# EasyEDA Pro project 12-4-202490deg_new pcb design_2024-12-04.epro

# Schematic Schematic1
Board Name: Board1; Create Date: 2024-11-25; Page Name: P1; Project Name: new pcb design; Schematic Name: Schematic1; Update Date: 2024-12-03; Company: EasyEDA.com; Page Size: A4; Version: V2.0
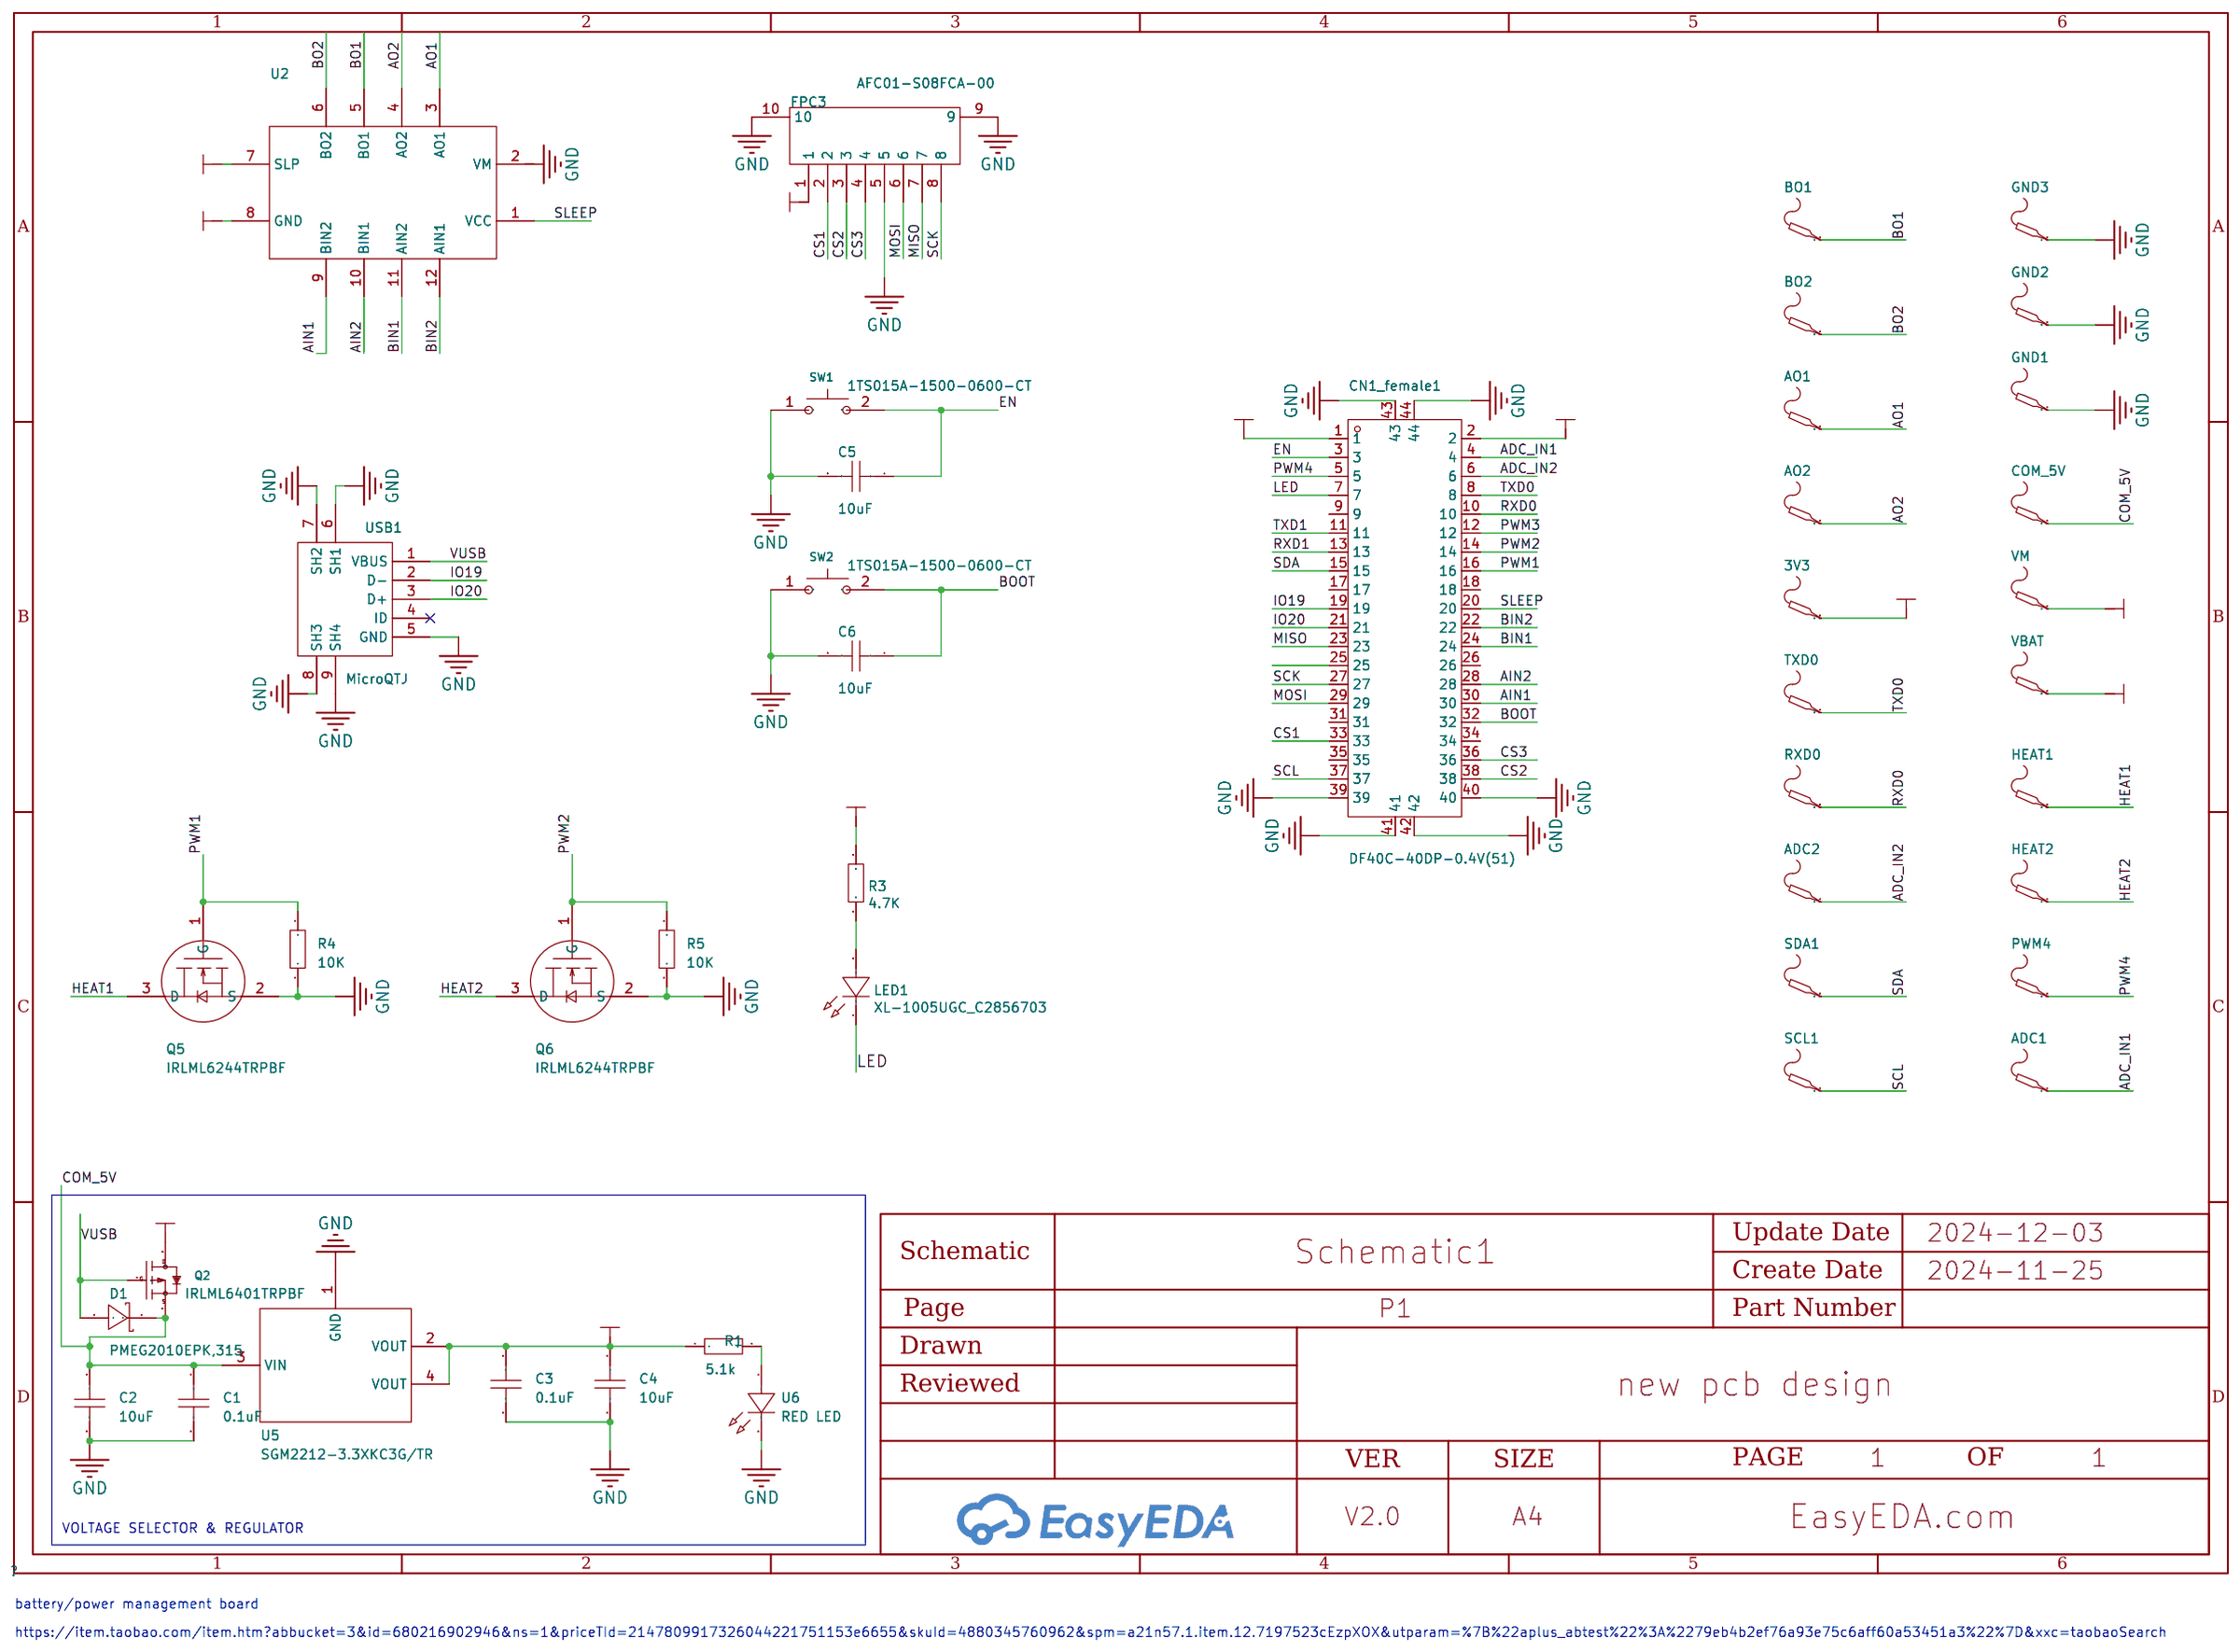
[diagram p0: schematic sheet]

## Parts
3V3  -  [Test-Point-0.5mm]
ADC1  -  [Test-Point-0.5mm]
ADC2  -  [Test-Point-0.5mm]
AO1  -  [Test-Point-0.5mm]
AO2  -  [Test-Point-0.5mm]
BO1  -  [Test-Point-0.5mm]
BO2  -  [Test-Point-0.5mm]
C1  0.1uF  [C0603]
C2  10uF  [C0603]
C3  0.1uF  [C0603]
C4  10uF  [C0603]
C5  10uF  [C0603]
C6  10uF  [C0603]
CN1_female1  DF40C-40DP-0.4V(51)  [CONN-SMD_DF40C-40DP-0.4V]
COM_5V  -  [Test-Point-0.5mm]
D1  PMEG2010EPK,315  [SOD1608_L1.6-W0.8-LS1.6-RD]
FPC3  AFC01-S08FCA-00  [FPC-SMD_P0.50-8P_FGS-XJ-H2.0]
GND1  -  [Test-Point-0.5mm]
GND2  -  [Test-Point-0.5mm]
GND3  -  [Test-Point-0.5mm]
HEAT1  -  [Test-Point-0.5mm]
HEAT2  -  [Test-Point-0.5mm]
LED1  XL-1005UGC_C2856703  [LED0402-RD_GREEN]
PWM4  -  [Test-Point-0.5mm]
Q2  IRLML6401TRPBF  [SOT-23-3_L2.9-W1.3-P1.90-LS2.4-BR]
Q5  IRLML6244TRPBF  [SOT-23-3_L2.9-W1.3-P1.90-LS2.4-BR]
Q6  IRLML6244TRPBF  [SOT-23-3_L2.9-W1.3-P1.90-LS2.4-BR]
R1  5.1k  [R0603]
R3  4.7K  [R0402]
R4  10K  [R0603]
R5  10K  [R0603]
RXD0  -  [Test-Point-0.5mm]
SCL1  -  [Test-Point-0.5mm]
SDA1  -  [Test-Point-0.5mm]
SW1  1TS015A-1500-0600-CT  [SW-SMD_L3.0-W2.0-LS3.5]
SW2  1TS015A-1500-0600-CT  [SW-SMD_L3.0-W2.0-LS3.5]
TXD0  -  [Test-Point-0.5mm]
U2  -  [DOUBLE_DRV8210]
U5  SGM2212-3.3XKC3G/TR  [SOT-223-4_L6.5-W3.5-P2.30-LS7.0-BR]
U6  RED LED  [LED0402-R-RD]
USB1  MicroQTJ  [MICRO-USB-SMD_MICROQTJ-5P]
VBAT  -  [Test-Point-0.5mm]
VM  -  [Test-Point-0.5mm]

## Library data of the parts
3V3 ADC1 ADC2 AO1 AO2 BO1 BO2 COM_5V GND1-GND3 HEAT1 HEAT2 PWM4 RXD0 SCL1 SDA1 TXD0 VBAT VM = Test-Point: Test Point 测试点
C1-C6 = CAP_0603: Supplier Footprint: 0603
CN1_female1 = DF40C-40DP-0.4V(51): Number of Pins:- Pitch:0.4mm Mounting Style:Standing paste Number of Rows:2 Current Rating (Max):300mA Contact Plating:Gold Operating Temperature Range:-35℃~+85℃ Operating Temperature Range:-35℃~+85℃; LCSC Part Name: 间距:0.4mm 公 立贴; Supplier Part: C424643; Manufacturer: HRS(广濑); Supplier Footprint: SMD,P=0.4mm; JLCPCB Part Class: Extended Part; Datasheet: https://atta.szlcsc.com/upload/public/pdf/source/20190903/C424648_4BEB475664B3701E3114D0DD20EED667.pdf; Supplier: LCSC; Pitch: 0.4mm; Mounting Style: Standing paste; Number of Rows: 2; Current Rating (Max): 300mA; Contact Plating: Gold; Operating Temperature Range: -35℃~+85℃
D1 = PMEG2010EPK,315: Forward Voltage (Vf@If):415mV@1A Reverse Voltage (Vr):20V Rectified Current:1A Reverse Leakage Current (Ir):600uA@20V; LCSC Part Name: 电压:20V 电流:1A; Supplier Part: C552829; Manufacturer: Nexperia(安世); Supplier Footprint: DFN1608-2; JLCPCB Part Class: Extended Part; Datasheet: https://atta.szlcsc.com/upload/public/pdf/source/20200610/C552829_3AF2334668204E48D61AA8E7CF1AE1A5.pdf; Supplier: LCSC; Forward Voltage (Vf@If): 415mV@1A; Reverse Voltage (Vr): 20V; Rectified Current: 1A; Reverse Leakage Current (Ir): 600uA@20V
FPC3 = AFC01-S08FCA-00: Locking Feature:Clamshell Contact Type:Bottom Contact Number of Contacts:8P Pitch:0.5mm Mounting Type:卧贴 FFC, FCB Thickness:0.3mm FFC, FCB Thickness:0.3mm Height Above Board:2mm; LCSC Part Name: 间距:0.5mm P数:8P 翻盖式 下接; Supplier Part: C262657; Manufacturer: JS(钜硕电子); Supplier Footprint: SMD,P=0.5mm,卧贴; JLCPCB Part Class: Extended Part; Datasheet: https://atta.szlcsc.com/upload/public/pdf/source/20190816/C413942_2A72D1AC756EAE17EEDF756A339D4500.pdf; Supplier: LCSC; Locking Feature: Clamshell; Contact Type: Bottom Contact; Number of Contacts: 8P; Pitch: 0.5mm; Mounting Type: 卧贴; FFC, FCB Thickness: 0.3mm; Height Above Board: 2mm
LED1 = XL-1005UGC_C2856703: link: https://so.szlcsc.com/global.html?k=C2856703&amp;ref=editor; 3DModel: LED0402_L1.0-W0.5-H0.2; Supplier: LCSC; Supplier Part: C2856703; Manufacturer: XINGLIGHT(成兴光); Manufacturer Part: XL-1005UGC; JLCPCB Part Class: Extended Part
Q2 = IRLML6401TRPBF_C5182042: Supplier Part: C5182042; Manufacturer: TECH PUBLIC(台舟); Supplier Footprint: SOT-23; Datasheet: https://atta.szlcsc.com/upload/public/pdf/source/20220927/F94DD8E07BE7777460EDDF0B320F674D.pdf; Supplier: LCSC
Q5 Q6 = IRLML6244TRPBF: Type:1 N-Channel Drain Source Voltage (Vdss): Continuous Drain Current (Id): Drain Source On Resistance (RDS(on)@Vgs,Id):21mΩ@4.5V,6.3A Power Dissipation (Pd): Gate Threshold Voltage (Vgs(th)@Id):0.9V@10uA Total Gate Charge (Qg@Vgs):8.9nC Input Capacitanc; LCSC Part Name: 1个N沟道 耐压:20V 电流:6.3A; Supplier Part: C143946; Manufacturer: Infineon(英飞凌); Supplier Footprint: SOT-23; JLCPCB Part Class: Extended Part; Datasheet: https://atta.szlcsc.com/upload/public/pdf/source/20171123/C143946_15114110845441137804.pdf; Supplier: LCSC; Type: 1 N-Channel; Drain Source On Resistance (RDS(on)@Vgs,Id): 21mΩ@4.5V,6.3A; Gate Threshold Voltage (Vgs(th)@Id): 0.9V@10uA; Total Gate Charge (Qg@Vgs): 8.9nC; Input Capacitance (Ciss@Vds): 700pF; Reverse Transfer Capacitance (Crss@Vds): 98pF; Operating Temperature: -55℃~+150℃
R1 R4 R5 = Res_0603: Supplier Footprint: 0603
R3 = 4.7K: link: https://so.szlcsc.com/global.html?k=C60490&amp;ref=editor; 3DModel: R0402_L1.0-W0.5-H0.5; Supplier: LCSC; Manufacturer: YAGEO(国巨); Manufacturer Part: RC0402FR-0710KL; Supplier Part: C60490; JLCPCB Part Class: Extended Part
SW1 SW2 = 1TS015A-1500-0600-CT: Circuit:SPST Actuator Style:Round Button Operating Force:150gf Mounting Style:Brick nogging Switch Length:3mm Switch Width:2mm Switch Height:0.6mm Strike Gundam:不带 Contact Current:50mA Voltage Rating (DC):12V Power Rating:0.6W Insulation Resistance:100MΩ; LCSC Part Name: 3*2*0.6mm 立贴 轻触开关; Supplier Part: C319434; Manufacturer: HYP(鸿源精密); Supplier Footprint: SMD,2x3mm; JLCPCB Part Class: Extended Part; Datasheet: https://atta.szlcsc.com/upload/public/pdf/source/20181106/C319434_B3AA23CF9D2B2E70128718BA7D32871A.pdf; Supplier: LCSC; Circuit: SPST; Actuator Style: Round Button; Operating Force: 150gf; Mounting Style: Brick nogging; Switch Length: 3mm; Switch Width: 2mm; Switch Height: 0.6mm; Strike Gundam: 不带; Contact Current: 50mA; Voltage Rating (DC): 12V; Power Rating: 0.6W; Insulation Resistance: 100MΩ; Actuator/Cap Color: Black; With Lamp: No; IP Rating: IP68; Pin Style: SMDSplicing; Mechanical Life: 30万次; Operating Temperature: -40℃~+90℃
U2 = DOUBLE_DRV8210
U5 = SGM2212-3.3XKC3G/TR: Supplier Part: C9900018517; Supplier Footprint: SOT-223-4; Supplier: LCSC
U6 = YLED0402G: LCSC Part Name: 发光管; Supplier Part: C20608784; Manufacturer: YONGYUTAI(永裕泰); Supplier Footprint: 0402; JLCPCB Part Class: Extended Part; Datasheet: https://atta.szlcsc.com/upload/public/pdf/source/20240119/2792316D86947EC95655E09EC4742546.pdf; Supplier: LCSC
USB1 = MicroQTJ: Connector Type:Micro-B Standard:USB 2.0 Gender:Female Mounting Style:Horizontal attachment Number of Contacts:5P Number of Ports:1 Current Rating - Power (Max):- Operating Temperature Range:-30℃~+80℃ Operating Temperature Range:-30℃~+80℃ Connect-Disconnec; LCSC Part Name: Micro-B 母 卧贴; Supplier Part: C404968; Manufacturer: SHOU HAN(首韩); Supplier Footprint: SMD; JLCPCB Part Class: Extended Part; Datasheet: https://atta.szlcsc.com/upload/public/pdf/source/20191210/C404968_B20FD489995C34B84F95A25A4974802C.pdf; Supplier: LCSC; Connector Type: Micro-B; Standard: USB 2.0; Gender: Female; Mounting Style: Horizontal attachment; Number of Contacts: 5P; Number of Ports: 1; Operating Temperature Range: -30℃~+80℃; Connect-Disconnect Life: 3000 times; Core Colour: Black

## Nets
GND: C1.2 C2.2 C3.1 C4.1 C5.2 C6.2 CN1_female1.39 CN1_female1.40 CN1_female1.41 CN1_female1.42 CN1_female1.43 CN1_female1.44 FPC3.5 FPC3.9 FPC3.10 GND1.1 GND2.1 GND3.1 Q5.2(S) Q6.2(S) R4.2 R5.2 SW1.1 SW2.1 U2.2(VM) U5.1(GND) U6.2(K) USB1.5(GND) USB1.6(SH1) USB1.7(SH2) USB1.8(SH3) USB1.9(SH4)
VBAT: Q2.3(D) VBAT.1
VCC_3V3: 3V3.1 C3.2 C4.2 CN1_female1.1 CN1_female1.2 FPC3.1 R1.1 R3.1 U2.7(SLP) U5.2(VOUT) U5.4(VOUT)
ADC_IN1: ADC1.1 CN1_female1.4
ADC_IN2: ADC2.1 CN1_female1.6
AIN1: CN1_female1.30 U2.9(BIN2)
AIN2: CN1_female1.28 U2.10(BIN1)
AO1: AO1.1 U2.3(AO1)
AO2: AO2.1 U2.4(AO2)
BIN1: CN1_female1.24 U2.11(AIN2)
BIN2: CN1_female1.22 U2.12(AIN1)
BO1: BO1.1 U2.5(BO1)
BO2: BO2.1 U2.6(BO2)
BOOT: C6.1 CN1_female1.32 SW2.2
COM_5V: C1.1 C2.1 COM_5V.1 D1.1(K) Q2.2(S) U5.3(VIN)
CS1: CN1_female1.33 FPC3.2
CS2: CN1_female1.38 FPC3.3
CS3: CN1_female1.36 FPC3.4
EN: C5.1 CN1_female1.3 SW1.2
HEAT1: HEAT1.1 Q5.3(D)
HEAT2: HEAT2.1 Q6.3(D)
IO19: CN1_female1.19 USB1.2(D-)
IO20: CN1_female1.21 USB1.3(D+)
LED: CN1_female1.7 LED1.1(K)
MISO: CN1_female1.23 FPC3.7
MOSI: CN1_female1.29 FPC3.6
PWM1: CN1_female1.16 Q5.1(G) R4.1
PWM2: CN1_female1.14 Q6.1(G) R5.1
PWM3: CN1_female1.12
PWM4: CN1_female1.5 PWM4.1
RXD0: CN1_female1.10 RXD0.1
RXD1: CN1_female1.13
SCK: CN1_female1.27 FPC3.8
SCL: CN1_female1.37 SCL1.1
SDA: CN1_female1.15 SDA1.1
SLEEP: CN1_female1.20 U2.1(VCC)
TXD0: CN1_female1.8 TXD0.1
TXD1: CN1_female1.11
VM: U2.8(GND) VM.1
VUSB: D1.2(A) Q2.1(G) USB1.1(VBUS)
$1N7567: R1.2 U6.1(A)
$1N10088: LED1.2(A) R3.2

Not connected (* = marked no-connect by the designer): CN1_female1 9 17 18 25 26 31 34 35; USB1 4(ID)*

## Notes on the sheet
- VOLTAGE SELECTOR & REGULATOR
- battery/power management board
- https://item.taobao.com/item.htm?abbucket=3&id=680216902946&ns=1&priceTId=2147809917326044221751153e6655&skuId=4880345760962&spm=a21n57.1.item.12.7197523cEzpXOX&utparam=%7B%22aplus_abtest%22%3A%2279eb4b2ef76a93e75c6aff60a53451a3%22%7D&xxc=taobaoSearch

# Schematic Schematic2
Board Name: Board2; Create Date: 2024-12-01; Page Name: P1; Project Name: new pcb design; Schematic Name: Schematic2; Update Date: 2024-12-01; Company: EasyEDA.com; Drawn: EasyEDA; Page Size: A4; Part Number: JLCPCB-002; Reviewed: EasyEDA; Version: V0.1
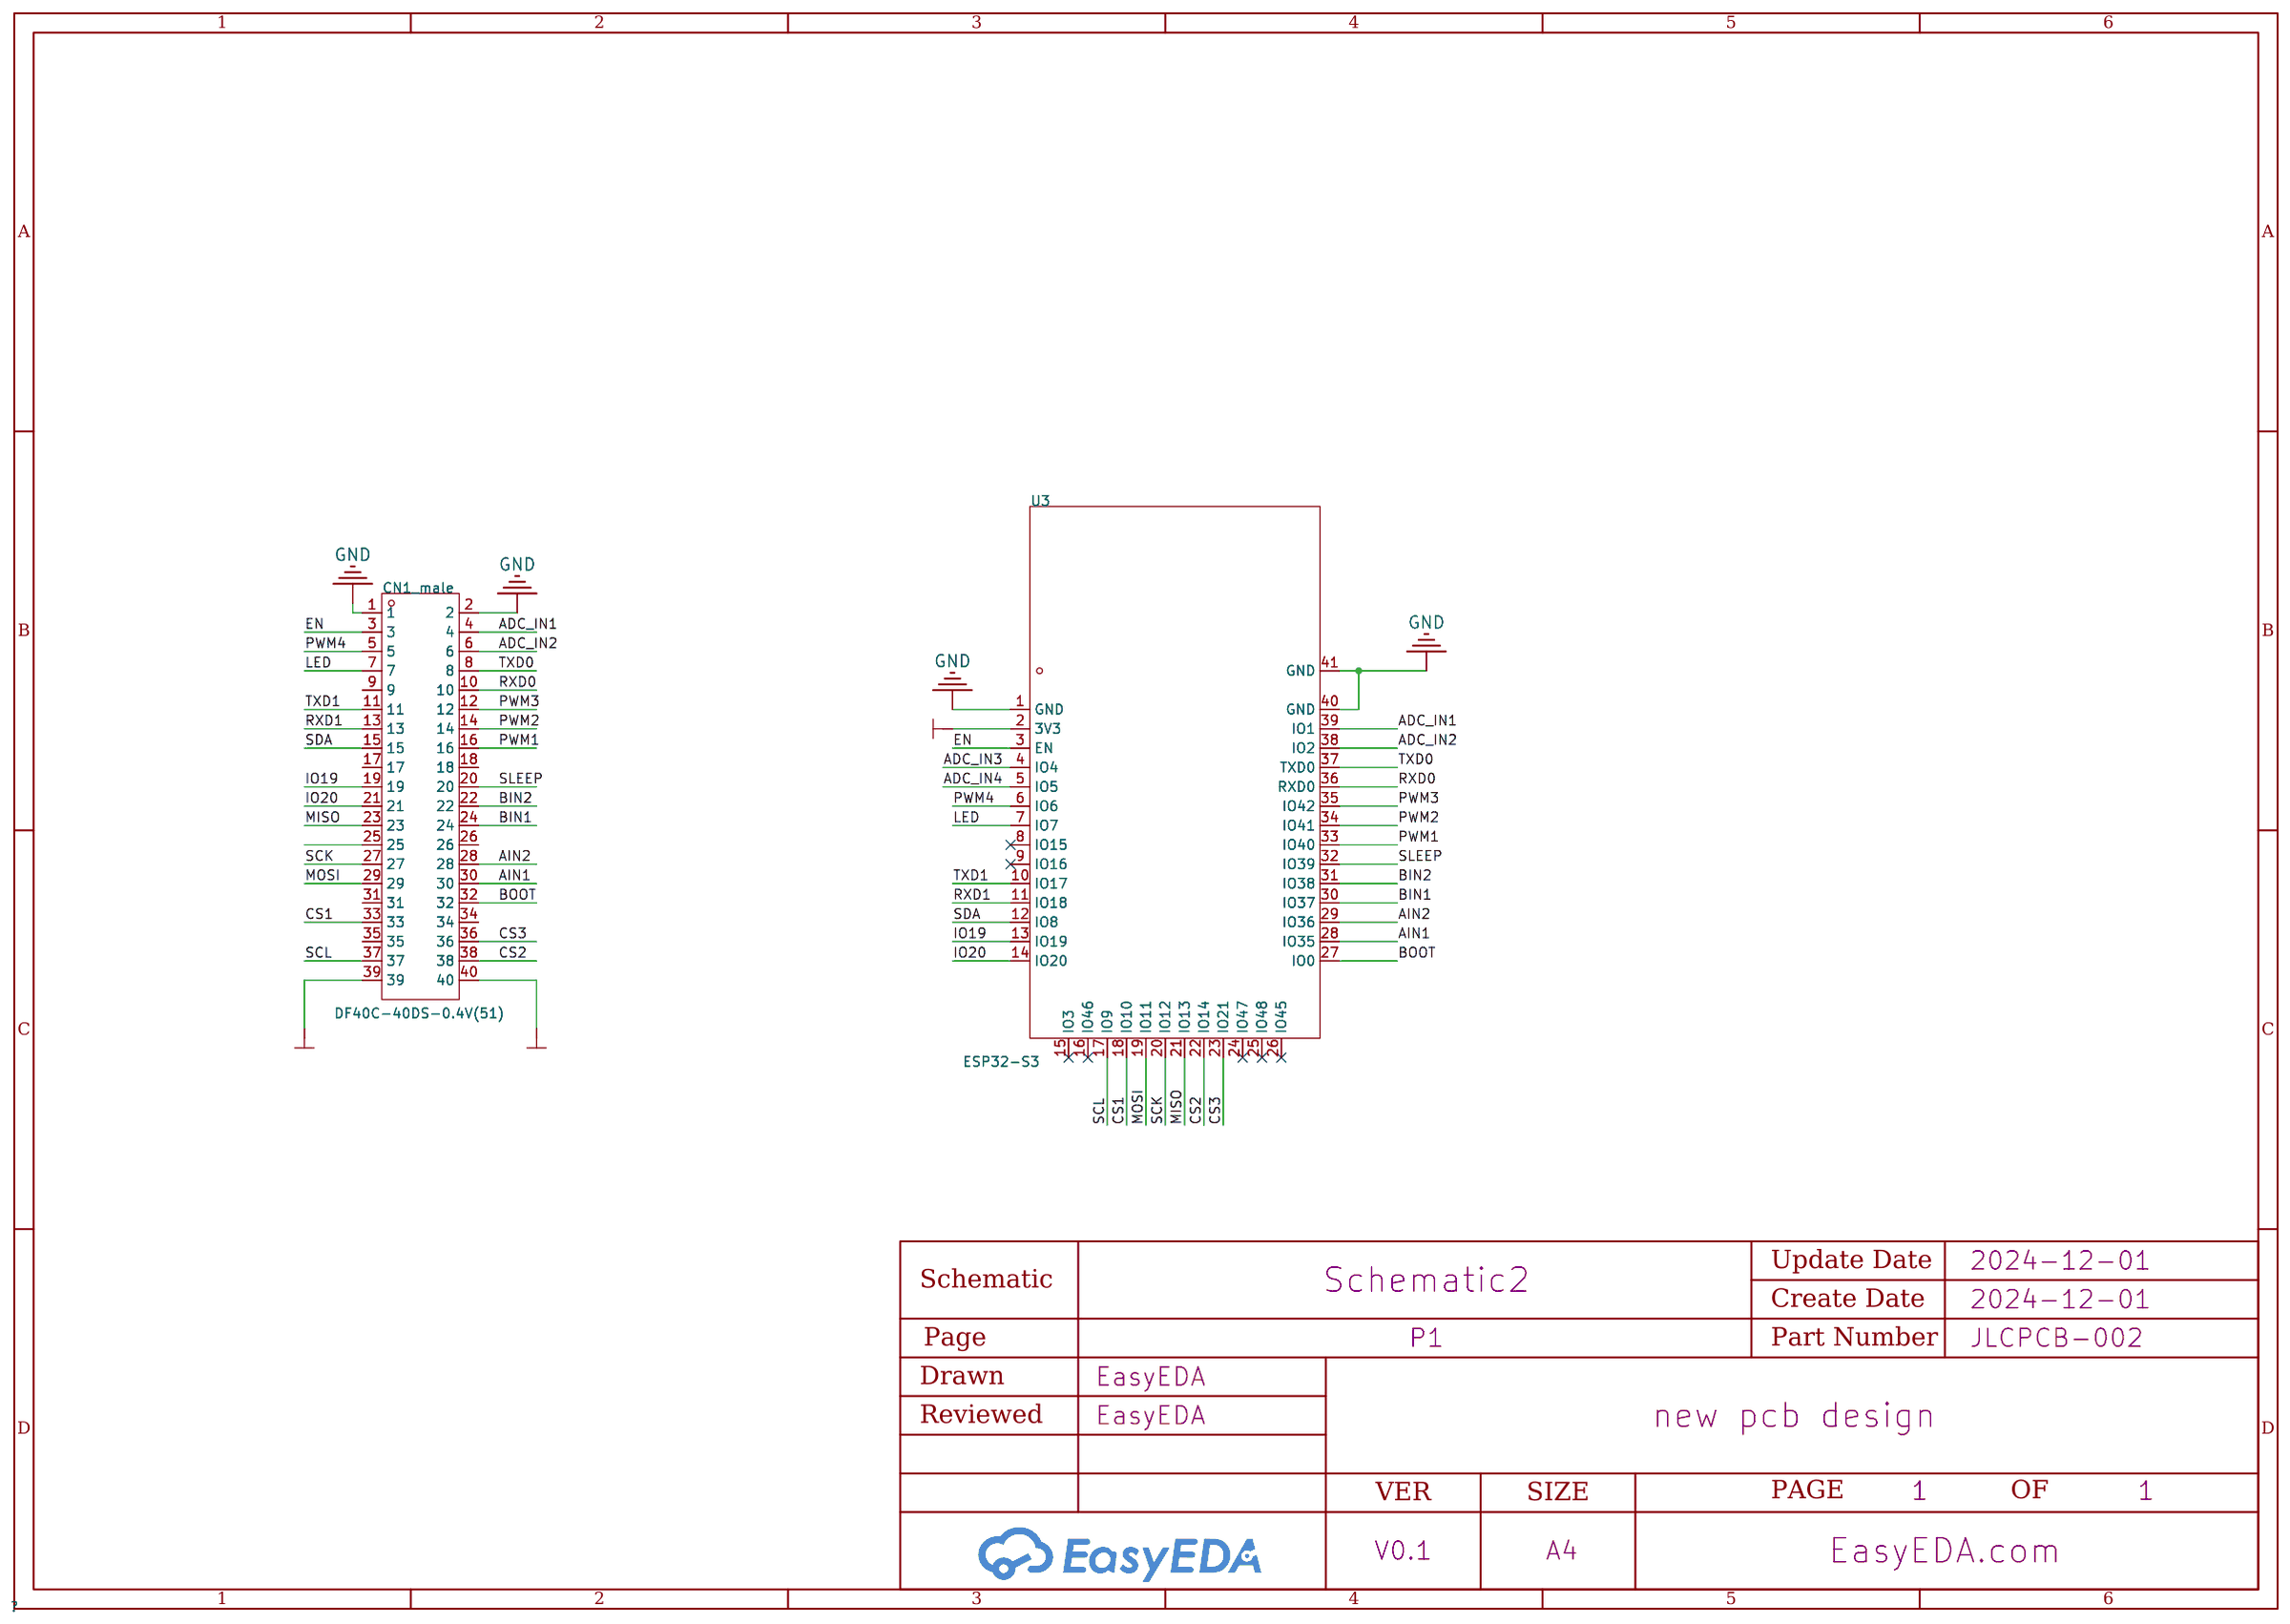
[diagram p1: schematic sheet]

## Parts
CN1_male  DF40C-40DS-0.4V(51)  [CONN-SMD_DF40C-40DS-0.4V51]
U3  ESP32-S3  [WIRELM-SMD_ESP32-S3-WROOM-1]

## Library data of the parts
CN1_male = DF40C-40DS-0.4V(51): Number of Pins:- Pitch:0.4mm Gender:Female Mounting Style:Brick nogging Number of Rows:2 Current Rating (Max):300mA Contact Plating:Gold Operating Temperature Range:-35℃~+85℃ Operating Temperature Range:-35℃~+85℃; LCSC Part Name: 间距:0.4mm 母 立贴; Supplier Part: C424644; Manufacturer: HRS(广濑); Supplier Footprint: SMD,P=0.4mm; JLCPCB Part Class: Extended Part; Datasheet: https://atta.szlcsc.com/upload/public/pdf/source/20200930/C424644_CB410DE97904F448B05F53B6B32B0FBB.pdf; Supplier: LCSC; Pitch: 0.4mm; Gender: Female; Mounting Style: Brick nogging; Number of Rows: 2; Current Rating (Max): 300mA; Contact Plating: Gold; Operating Temperature Range: -35℃~+85℃
U3 = ESP32-S3-WROOM-1-N8R2: Core Processor:ESP32-S3 Chip Support Interface:I2C；GPIO；SPI；PWM；ADC；UART；USB；I2S Frequency:2.4GHz; LCSC Part Name: 通用型Wi-Fi+低功耗蓝牙MCU模组; Supplier Part: C2913204; Manufacturer: ESPRESSIF(乐鑫); Supplier Footprint: SMD,18x25.5mm; JLCPCB Part Class: Extended Part; Datasheet: https://atta.szlcsc.com/upload/public/pdf/source/20241030/6A412B13087E1327DF6279F5735253CA.pdf; Supplier: LCSC; Core Processor: ESP32-S3 Chip; Support Interface: I2C；GPIO；SPI；PWM；ADC；UART；USB；I2S

## Nets
GND: CN1_male.1 CN1_male.2 U3.1(GND) U3.40(GND) U3.41(GND)
VCC_3V3: CN1_male.39 CN1_male.40 U3.2(3V3)
ADC_IN1: CN1_male.4 U3.39(IO1)
ADC_IN2: CN1_male.6 U3.38(IO2)
ADC_IN3: U3.4(IO4)
ADC_IN4: U3.5(IO5)
AIN1: CN1_male.30 U3.28(IO35)
AIN2: CN1_male.28 U3.29(IO36)
BIN1: CN1_male.24 U3.30(IO37)
BIN2: CN1_male.22 U3.31(IO38)
BOOT: CN1_male.32 U3.27(IO0)
CS1: CN1_male.33 U3.18(IO10)
CS2: CN1_male.38 U3.22(IO14)
CS3: CN1_male.36 U3.23(IO21)
EN: CN1_male.3 U3.3(EN)
IO19: CN1_male.19 U3.13(IO19)
IO20: CN1_male.21 U3.14(IO20)
LED: CN1_male.7 U3.7(IO7)
MISO: CN1_male.23 U3.21(IO13)
MOSI: CN1_male.29 U3.19(IO11)
PWM1: CN1_male.16 U3.33(IO40)
PWM2: CN1_male.14 U3.34(IO41)
PWM3: CN1_male.12 U3.35(IO42)
PWM4: CN1_male.5 U3.6(IO6)
RXD0: CN1_male.10 U3.36(RXD0)
RXD1: CN1_male.13 U3.11(IO18)
SCK: CN1_male.27 U3.20(IO12)
SCL: CN1_male.37 U3.17(IO9)
SDA: CN1_male.15 U3.12(IO8)
SLEEP: CN1_male.20 U3.32(IO39)
TXD0: CN1_male.8 U3.37(TXD0)
TXD1: CN1_male.11 U3.10(IO17)

Not connected (* = marked no-connect by the designer): CN1_male 9 17 18 25 26 31 34 35; U3 8(IO15)* 9(IO16)* 15(IO3)* 16(IO46)* 24(IO47)* 25(IO48)* 26(IO45)*

# Board PCB2
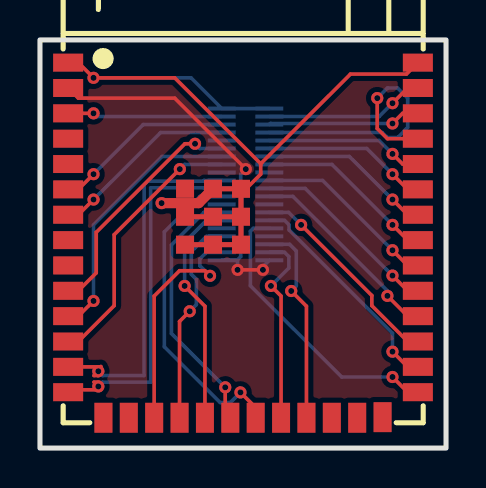
[diagram p2: board, top side]
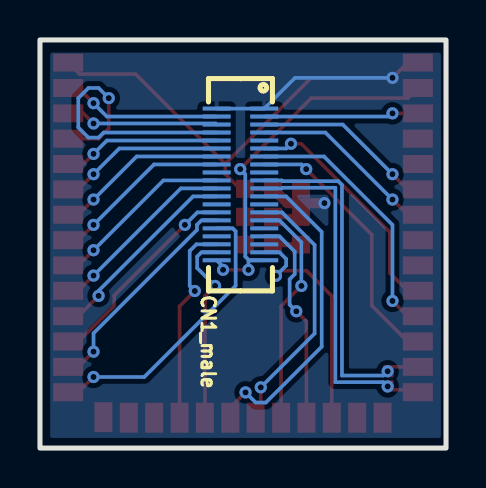
[diagram p3: board, bottom side, seen from below]

Outline 20.32 x 20.45 mm; copper layers: Top Layer, Bottom Layer. Coordinates in mm from the lower left corner of the outline.
Outline path: rectangle 0,20.45 20.32,0
Stack: Top Layer 0.035mm / Dielectric1 0.31mm FR4 er 4.5 / Bottom Layer 0.035mm

## Design rules (mm)
net IO20: DP1
net IO19: DP1
template: JLCPCB Capability(Two Layers Board)
spacing copperThickness1oz (default): track to track 0.102, other pairs 0.152 to 0.3
spacing copperThickness2oz: track to track 0.203, other pairs 0.152 to 0.3
track width copperThickness1oz (default): min 0.127, default 0.254, max 2.54
track width copperThickness2oz: min 0.203, default 0.254, max 2.54
differential pair differentialPair (default): width min 0.127, default 0.254, max 2.54; gap min 0.152, default 0.152
via viaSize (default): diameter min 0.5, default 0.61, max 10; hole min 0.3, default 0.305, max 6.3

## Placement (name value [footprint] x y rotation side)
CN1_male  DF40C-40DS-0.4V(51)  [CONN-SMD_DF40C-40DS-0.4V51]  10.29 13.21 90 bottom
U3  ESP32-S3  [WIRELM-SMD_ESP32-S3-WROOM-1]  10.16 10.41 0 top

## Footprints (pads in the part's own frame, mm; a bottom-side part is the same pattern mirrored in y, then rotated)
CONN-SMD_DF40C-40DS-0.4V51
  rect 0.2x1.4 smd: 1(3.8,-1.19) 2(3.8,1.19) 3(3.4,-1.19) 4(3.4,1.19) 5(3,-1.19) 6(3,1.19) 7(2.6,-1.19) 8(2.6,1.19) 9(2.2,-1.19) 10(2.2,1.19) 11(1.8,-1.19) 12(1.8,1.19) 13(1.4,-1.19) 14(1.4,1.19) 15(1,-1.19) 16(1,1.19) 17(0.6,-1.19) 18(0.6,1.19) 19(0.2,-1.19) 20(0.2,1.19) 21(-0.2,-1.19) 22(-0.2,1.19) 23(-0.6,-1.19) 24(-0.6,1.19) 25(-1,-1.19) 26(-1,1.19) 27(-1.4,-1.19) 28(-1.4,1.19) 29(-1.8,-1.19) 30(-1.8,1.19) 31(-2.2,-1.19) 32(-2.2,1.19) 33(-2.6,-1.19) 34(-2.6,1.19) 35(-3,-1.19) 36(-3,1.19) 37(-3.4,-1.19) 38(-3.4,1.19) 39(-3.8,-1.19) 40(-3.8,1.19)
WIRELM-SMD_ESP32-S3-WROOM-1
  rect 1.5x0.9 smd: 1(-8.75,8.895) 2(-8.75,7.625) 3(-8.75,6.355) 4(-8.75,5.085) 5(-8.75,3.815) 6(-8.75,2.545) 7(-8.75,1.275) 8(-8.75,0.005) 9(-8.75,-1.265) 10(-8.75,-2.535) 11(-8.75,-3.805) 12(-8.75,-5.075) 13(-8.75,-6.345) 14(-8.75,-7.615) 27(8.75,-7.615) 28(8.75,-6.345) 29(8.75,-5.075) 30(8.75,-3.805) 31(8.75,-2.535) 32(8.75,-1.265) 33(8.75,0.005) 34(8.75,1.275) 35(8.75,2.545) 36(8.75,3.815) 37(8.75,5.085) 38(8.75,6.355) 39(8.75,7.625) 40(8.75,8.895)
  rect 0.9x1.5 smd: 15(-6.985,-8.895) 16(-5.715,-8.895) 17(-4.445,-8.895) 18(-3.175,-8.895) 19(-1.905,-8.895) 20(-0.635,-8.895) 21(0.635,-8.895) 22(1.905,-8.895) 23(3.175,-8.895) 24(4.445,-8.895) 25(5.715,-8.895) 26(6.985,-8.865)
  rect 0.9x0.9 smd: 41(-2.9,2.575) 41(-2.9,1.175) 41(-2.9,-0.225) 41(-1.5,2.575) 41(-1.5,1.175) 41(-1.5,-0.225) 41(-0.1,2.575) 41(-0.1,1.175) 41(-0.1,-0.225)

## Nets
As in the schematic.

Pads without a net: CN1_male 9 17 18 26 31 34 35; U3 8 9 15 16 24 25 26

## Via types
v1: diameter 0.61, hole 0.305, Top Layer to Bottom Layer, 33 vias

## Routing (per net, layer and track width the routed paths; a pad name or vN(x,y) marks a point on that pad's centre or on a via; arc(x,y) is an arc through that point)
GND: length 45.6
  Top Layer w0.18: 11.05,14.25 6.74,18.55 v1(2.68,18.55) 1.92,19.31 U3.1 ; 11.05,14.25 11.05,13.72 10.31,12.99 U3.41 ; 11.05,14.25 15.54,18.74 18.34,18.74 U3.40
  Top Layer w0.254: U3.41 U3.41 U3.41 ; U3.41 U3.41 U3.41 U3.41 ; U3.41 U3.41 U3.41
  Top Layer w0.508: v1(6.09,12.27) 7.94,12.27 U3.41
  Bottom Layer w0.18: CN1_male.2 CN1_male.1 7.56,18.55 v1(2.68,18.55)
VCC_3V3: length 18.5
  Top Layer w0.18: v1(10.3,13.98) 6.74,17.53 1.92,17.53 U3.2 ; v1(9.89,8.93) v1(11.16,8.93)
  Bottom Layer w0.18: 9.89,9.44 9.86,9.41 CN1_male.39 ; 9.89,9.44 v1(9.89,8.93) ; 9.89,9.44 10.05,9.6 10.05,13.72 v1(10.3,13.98) ; CN1_male.40 11.16,9.09 v1(11.16,8.93)
ADC_IN1: length 8
  Top Layer w0.18: v1(17.64,17.28) 18.4,18.04 U3.39
  Bottom Layer w0.18: CN1_male.4 16.97,16.61 v1(17.64,17.28)
ADC_IN2: length 7.7
  Top Layer w0.18: U3.38 18.15,16.77 v1(17.64,16.26)
  Bottom Layer w0.18: v1(17.64,16.26) 11.53,16.26 CN1_male.6
AIN1: length 11.2
  Top Layer w0.18: v1(17.64,4.83) 18.4,4.07 U3.28
  Bottom Layer w0.18: CN1_male.30 12.24,11.41 12.47,11.18 12.47,10.93 17.64,5.75 v1(17.64,4.83)
AIN2: length 10.4
  Top Layer w0.18: v1(13.07,11.18) 16.61,7.64 16.61,7.14 18.4,5.34 18.91,5.34
  Bottom Layer w0.18: v1(13.07,11.18) 12.44,11.81 CN1_male.28
BIN1: length 10.1
  Top Layer w0.18: U3.30 18.4,6.61 v1(17.39,7.62)
  Bottom Layer w0.18: CN1_male.24 12.66,12.61 17.39,7.88 v1(17.39,7.62)
BIN2: length 9.6
  Top Layer w0.18: U3.31 18.4,7.88 v1(17.64,8.64)
  Bottom Layer w0.18: CN1_male.22 13.27,13.01 v1(17.64,8.64)
BOOT: length 14.3
  Top Layer w0.18: U3.27 18.4,2.8 v1(17.64,3.56)
  Bottom Layer w0.18: v1(17.64,3.56) 15.1,3.56 10.53,8.13 10.53,10.86 10.67,11.01 CN1_male.32
CS1: length 10.6
  Top Layer w0.18: 6.99,1.52 6.99,6.35 v1(7.49,6.85)
  Bottom Layer w0.18: v1(7.49,6.85) 7.83,7.19 7.83,8.46 7.57,8.71 7.57,9.85 8.34,10.61 CN1_male.33
CS2: length 9.7
  Top Layer w0.18: v1(11.56,8.12) 12.06,7.62 U3.22
  Bottom Layer w0.18: CN1_male.38 12.24,9.81 12.46,9.59 12.46,9.02 v1(11.56,8.12)
CS3: length 10.3
  Top Layer w0.18: U3.23 13.34,7.11 v1(12.57,7.87)
  Bottom Layer w0.18: v1(12.57,7.87) 12.83,8.12 12.83,9.87 12.49,10.21 CN1_male.36
EN: length 7.8
  Top Layer w0.18: U3.3 v1(2.68,16.77)
  Bottom Layer w0.18: CN1_male.3 2.84,16.61 v1(2.68,16.77)
IO19: length 17.6
  Top Layer w0.18: 1.93,4.07 3.05,4.07 3.05,4.09 ; 2.92,3.63 2.71,3.63 v1(2.92,3.85)
  Bottom Layer w0.18: CN1_male.19 8.22,13.41 8.18,13.37 5.4,13.37 5.21,13.18 5.21,3.63 3.14,3.63 v1(2.92,3.85)
IO20: length 17.6
  Top Layer w0.18: 2.03,2.92 3.05,2.92 ; v1(2.92,3.09) 2.71,3.3 2.92,3.3
  Bottom Layer w0.18: v1(2.92,3.09) 3.14,3.3 5.54,3.3 5.54,13.04 8.18,13.04 8.22,13.01 CN1_male.21
LED: length 9.4
  Top Layer w0.18: U3.7 1.92,11.69 v1(2.68,12.45)
  Bottom Layer w0.18: CN1_male.7 6.04,15.81 v1(2.68,12.45)
MISO: length 16.1
  Top Layer w0.18: v1(10.03,2.79) 10.8,2.03 U3.21
  Bottom Layer w0.18: v1(10.03,2.79) 9.53,2.28 9.02,2.28 6.22,5.08 6.22,10.83 8,12.61 CN1_male.23
MOSI: length 11.5
  Top Layer w0.18: U3.19 8.25,7.11 v1(7.24,8.12)
  Bottom Layer w0.18: CN1_male.29 8.34,11.41 7.24,10.31 v1(7.24,8.12)
PWM1: length 9
  Top Layer w0.18: 18.91,10.42 18.4,10.42 v1(17.64,11.18)
  Bottom Layer w0.18: v1(17.64,11.18) 14.61,14.21 CN1_male.16
PWM2: length 8.6
  Top Layer w0.18: v1(17.64,12.45) 18.4,11.69 U3.34
  Bottom Layer w0.18: CN1_male.14 15.48,14.61 v1(17.64,12.45)
PWM3: length 8.3
  Top Layer w0.18: v1(17.64,13.72) 18.4,12.96 U3.35
  Bottom Layer w0.18: v1(17.64,13.72) 16.35,15.01 CN1_male.12
PWM4: length 9
  Top Layer w0.18: U3.6 1.92,12.96 v1(2.68,13.72)
  Bottom Layer w0.18: CN1_male.5 5.17,16.21 v1(2.68,13.72)
RXD0: length 7.9
  Top Layer w0.18: U3.36 18.15,14.23 v1(17.64,14.74)
  Bottom Layer w0.18: v1(17.64,14.74) 16.97,15.41 CN1_male.10
RXD1: length 13.2
  Top Layer w0.18: v1(2.68,7.37) 1.92,6.61 U3.11
  Bottom Layer w0.18: CN1_male.13 6.11,14.61 2.68,11.18 v1(2.68,7.37)
SCK: length 13.1
  Top Layer w0.18: v1(9.27,3.04) 9.27,1.77 U3.20
  Bottom Layer w0.18: v1(9.27,3.04) 6.58,5.74 6.58,10.18 8.21,11.81 CN1_male.27
SCL: length 11.8
  Top Layer w0.18: U3.17 5.72,7.62 6.99,8.89 8.25,8.89 v1(8.51,8.63)
  Bottom Layer w0.18: v1(8.51,8.63) 8,9.14 8,9.47 8.34,9.81 CN1_male.37
SDA: length 13.4
  Top Layer w0.18: v1(7,13.98) 3.71,10.69 3.71,7.14 1.92,5.34 1.41,5.34
  Bottom Layer w0.18: v1(7,13.98) 7.23,14.21 CN1_male.15
SLEEP: length 9.2
  Top Layer w0.18: v1(17.64,9.91) 18.4,9.15 U3.32
  Bottom Layer w0.18: CN1_male.20 14.14,13.41 v1(17.64,9.91)
TXD0: length 14.4
  Top Layer w0.18: v1(16.88,17.53) 16.88,16.01 17.39,15.5 18.91,15.5
  Bottom Layer w0.18: CN1_male.8 17.13,15.81 17.39,15.55 17.89,15.55 18.4,16.06 18.4,17.53 17.89,18.04 17.39,18.04 v1(16.88,17.53)
TXD1: length 12
  Top Layer w0.18: U3.10 1.92,7.88 2.82,8.78 2.82,10.81 7.25,15.25 v1(7.76,15.25)
  Bottom Layer w0.18: CN1_male.11 8,15.01 v1(7.76,15.25)

## Copper pours and planes (outline as drawn; the poured copper is in the pictures)
GND on Bottom Layer: 0.25,19.81 19.81,19.81 19.81,0.51 0.25,0.51
VCC_3V3 on Top Layer: 0.25,19.81 19.69,19.81 19.69,0.38 0.25,0.38

# Board PCB1
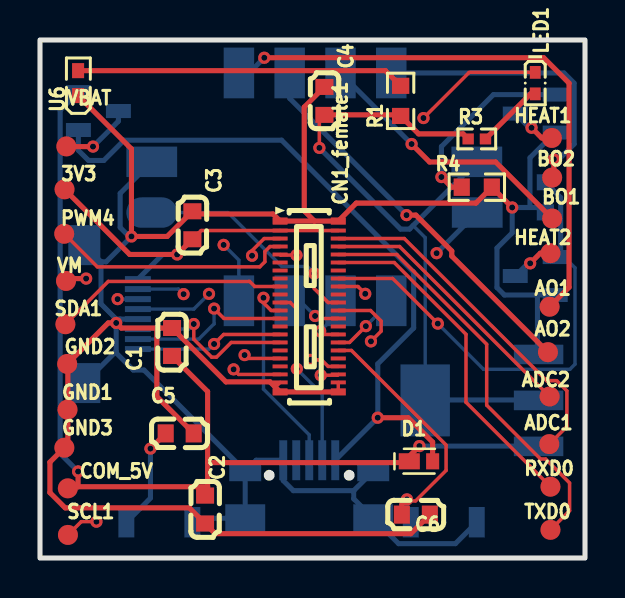
[diagram p4: board, top side]
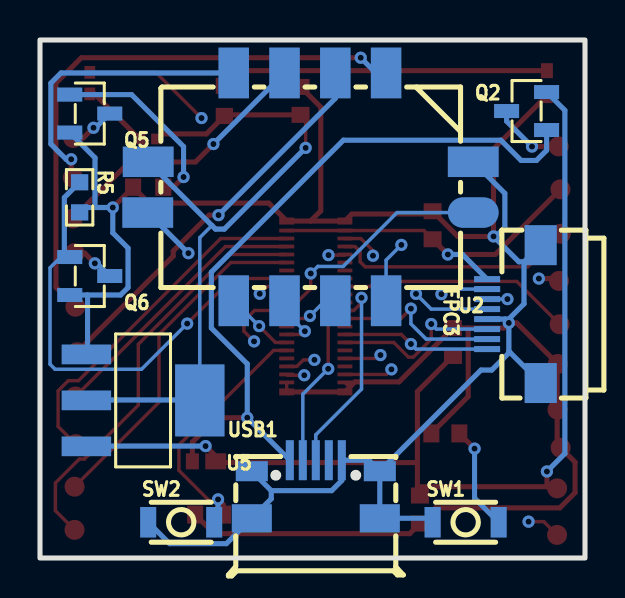
[diagram p5: board, bottom side, seen from below]

Outline 27.25 x 25.92 mm; copper layers: Top Layer, GND, VCC, Bottom Layer. Coordinates in mm from the lower left corner of the outline.
Outline path: rectangle 0,25.92 27.25,0
Stack: Top Layer 0.035mm Outer layer copper thickness 1oz / Dielectric1 0.08mm 7628 RC49% 8.6mil / GND 0.035mm Inner layer copper thickness / Dielectric2 0.08mm 1.1mm H/HOZ Copper / VCC 0.035mm Inner layer copper thickness / Dielectric3 0.08mm 7628 RC49% 8.6mil / Bottom Layer 0.035mm Outer layer copper thickness 1oz

## Design rules (mm)
net IO19: DP1
net IO20: DP1
template: Custom Config
spacing copperThickness1oz (default): track to track 0.102, other pairs 0.152 to 0.3
spacing copperThickness2oz: track to track 0.203, other pairs 0.152 to 0.3
track width copperThickness1oz (default): min 0.127, default 0.254, max 2.54
track width copperThickness2oz: min 0.203, default 0.254, max 2.54
differential pair differentialPair (default): width min 0.127, default 0.254, max 2.54; gap min 0.152, default 0.152
via viaSize (default): diameter min 0.5, default 0.61, max 10; hole min 0.3, default 0.305, max 6.3

## Placement (name value [footprint] x y rotation side)
3V3  -  [Test-Point-0.5mm]  1.23 18.45 0 top
ADC1  -  [Test-Point-0.5mm]  25.47 5.7 270 top
ADC2  -  [Test-Point-0.5mm]  25.48 8.08 0 top
AO1  -  [Test-Point-0.5mm]  25.48 12.57 0 top
AO2  -  [Test-Point-0.5mm]  25.4 10.3 0 top
BO1  -  [Test-Point-0.5mm]  25.61 16.99 0 top
BO2  -  [Test-Point-0.5mm]  25.61 19.03 0 top
C1  0.1uF  [C0603]  6.6 10.81 90 top
C2  10uF  [C0603]  8.25 2.43 270 top
C3  0.1uF  [C0603]  7.62 16.65 270 top
C4  10uF  [C0603]  14.22 22.87 270 top
C5  10uF  [C0603]  6.99 6.24 0 top
C6  10uF  [C0603]  18.8 2.17 0 top
CN1_female1  DF40C-40DP-0.4V(51)  [CONN-SMD_DF40C-40DP-0.4V]  13.46 12.59 270 top
COM_5V  -  [Test-Point-0.5mm]  1.39 3.49 0 top
D1  PMEG2010EPK,315  [SOD1608_L1.6-W0.8-LS1.6-RD]  19.05 4.84 0 top
FPC3  AFC01-S08FCA-00  [FPC-SMD_P0.50-8P_FGS-XJ-H2.0]  3.56 12.21 270 bottom
GND1  -  [Test-Point-0.5mm]  1.38 7.42 0 top
GND2  -  [Test-Point-0.5mm]  1.36 9.71 0 top
GND3  -  [Test-Point-0.5mm]  1.22 5.52 0 top
HEAT1  -  [Test-Point-0.5mm]  25.6 21.02 270 top
HEAT2  -  [Test-Point-0.5mm]  25.53 15.25 180 top
LED1  XL-1005UGC_C2856703  [LED0402-RD_GREEN]  24.76 23.76 270 top
PWM4  -  [Test-Point-0.5mm]  1.21 16.23 0 top
Q2  IRLML6401TRPBF  [SOT-23-3_L2.9-W1.3-P1.90-LS2.4-BR]  2.92 22.37 180 bottom
Q5  IRLML6244TRPBF  [SOT-23-3_L2.9-W1.3-P1.90-LS2.4-BR]  24.76 22.24 0 bottom
Q6  IRLML6244TRPBF  [SOT-23-3_L2.9-W1.3-P1.90-LS2.4-BR]  24.76 14.11 0 bottom
R1  5.1k  [R0603]  18.03 22.87 90 top
R3  4.7K  [R0402]  21.84 20.97 0 top
R4  10K  [R0603]  21.84 18.56 0 top
R5  10K  [R0603]  25.27 18.05 270 bottom
RXD0  -  [Test-Point-0.5mm]  25.53 3.57 0 top
SCL1  -  [Test-Point-0.5mm]  1.4 1.16 0 top
SDA1  -  [Test-Point-0.5mm]  1.27 11.7 270 top
SW1  1TS015A-1500-0600-CT  [SW-SMD_L3.0-W2.0-LS3.5]  5.97 1.79 180 bottom
SW2  1TS015A-1500-0600-CT  [SW-SMD_L3.0-W2.0-LS3.5]  20.19 1.79 180 bottom
TXD0  -  [Test-Point-0.5mm]  25.53 1.41 0 top
U2  -  [DOUBLE_DRV8210]  6.22 13.48 0 bottom
U5  SGM2212-3.3XKC3G/TR  [SOT-223-4_L6.5-W3.5-P2.30-LS7.0-BR]  22.1 7.89 0 bottom
U6  RED LED  [LED0402-R-RD]  1.91 23.76 90 top
USB1  MicroQTJ  [MICRO-USB-SMD_MICROQTJ-5P]  13.46 3.44 180 bottom
VBAT  -  [Test-Point-0.5mm]  1.32 20.6 0 top
VM  -  [Test-Point-0.5mm]  1.3 13.86 0 top

## Footprints (pads in the part's own frame, mm; a bottom-side part is the same pattern mirrored in y, then rotated)
C0603
  rect 0.8x0.9 smd: 1(-0.7,0) 2(0.7,0)
CONN-SMD_DF40C-40DP-0.4V
  rect 0.19x0.75 smd: 1(-3.8,-1.455) 2(-3.8,1.455) 3(-3.4,-1.455) 4(-3.4,1.455) 5(-3,-1.455) 6(-3,1.455) 7(-2.6,-1.455) 8(-2.6,1.455) 9(-2.2,-1.455) 10(-2.2,1.455) 11(-1.8,-1.455) 12(-1.8,1.455) 13(-1.4,-1.455) 14(-1.4,1.455) 15(-1,-1.455) 16(-1,1.455) 17(-0.6,-1.455) 18(-0.6,1.455) 19(-0.2,-1.455) 20(-0.2,1.455) 21(0.2,-1.455) 22(0.2,1.455) 23(0.6,-1.455) 24(0.6,1.455) 25(1,-1.455) 26(1,1.455) 27(1.4,-1.455) 28(1.4,1.455) 29(1.8,-1.455) 30(1.8,1.455) 31(2.2,-1.455) 32(2.2,1.455) 33(2.6,-1.455) 34(2.6,1.455) 35(3,-1.455) 36(3,1.455) 37(3.4,-1.455) 38(3.4,1.455) 39(3.8,-1.455) 40(3.8,1.455)
  rect 0.35x0.75 smd: 41(4.275,-1.455) 42(4.275,1.455) 43(-4.275,1.455) 44(-4.275,-1.455)
DOUBLE_DRV8210
  oval 2.54x1.524 smd: 1(-0.635,-3.81)
  rect 2.54x1.524 smd: 2(-0.635,-6.35) 7(15.621,-6.35) 8(15.642,-3.81)
  rect 1.524x2.54 smd: 3(3.723,-10.795) 4(6.263,-10.795) 5(8.803,-10.795) 6(11.343,-10.795) 9(11.343,0.602) 10(8.803,0.602) 11(6.263,0.602) 12(3.723,0.602)
FPC-SMD_P0.50-8P_FGS-XJ-H2.0
  rect 0.3x1.3 smd: 1(-1.75,-1.34) 2(-1.252,-1.339) 3(-0.75,-1.34) 4(-0.25,-1.34) 5(0.25,-1.34) 6(0.75,-1.34) 7(1.25,-1.34) 8(1.75,-1.34)
  rect 2x1.6 smd: 9(3.45,1.34) 10(-3.45,1.34)
LED0402-R-RD
  rect 0.75x0.6 smd: 1(0.623,0) 2(-0.623,0)
LED0402-RD_GREEN
  rect 0.636x0.54 smd: 1(-0.538,0) 2(0.538,0)
MICRO-USB-SMD_MICROQTJ-5P
  rect 0.4x2 smd: 1(-1.3,1.452) 2(-0.65,1.452) 3(0,1.452) 4(0.65,1.452) 5(1.3,1.452)
  rect 1.6x1 smd: 6(-3.2,0.901) 9(3.2,0.901)
  rect 2x1.4 smd: 7(-3.2,-1.452) 8(3.2,-1.452)
R0402
  rect 0.566x0.54 smd: 1(-0.433,0) 2(0.433,0)
R0603
  rect 0.806x0.864 smd: 1(-0.753,0) 2(0.753,0)
SOD1608_L1.6-W0.8-LS1.6-RD
  rect 1.049x0.8 smd: 1(-0.584,0)
  rect 0.65x0.8 smd: 2(0.584,0)
SOT-23-3_L2.9-W1.3-P1.90-LS2.4-BR
  rect 1.25x0.7 smd: 1(1,-0.95) 2(1,0.95) 3(-1,0)
SOT-223-4_L6.5-W3.5-P2.30-LS7.0-BR
  rect 2.47x0.98 smd: 1(2.835,-2.3) 2(2.835,0) 3(2.835,2.3)
  rect 2.47x3.6 smd: 4(-2.835,0)
SW-SMD_L3.0-W2.0-LS3.5
  rect 0.8x1.524 smd: 1(-1.651,0) 2(1.651,0)
Test-Point-0.5mm
  round 1 smd: 1(0,0)

## Nets
As in the schematic.

Pads without a net: CN1_female1 9 17 18 26 31 34 35; USB1 4

## Via types
v1: diameter 0.61, hole 0.305, Top Layer to Bottom Layer, 44 vias

## Routing (per net, layer and track width the routed paths; a pad name or vN(x,y) marks a point on that pad's centre or on a via; arc(x,y) is an arc through that point)
GND: length 149
  Top Layer w0.171: 11.73,8.59 11.81,8.59 12.01,8.79 ; CN1_female1.42 14.92,8.79
  Top Layer w0.254: 5.84,11.51 C1.2 9.3,8.81 11.5,8.81 12.01,8.31 CN1_female1.42 ; 5.84,11.51 4.06,11.51 v1(3.81,11.76) 3.41,11.76 1.39,9.74 ; 5.84,11.51 5.84,8.08 C5.2 ; 1.39,7.44 GND1.1 ; 1.39,7.44 1.39,5.69 GND3.1 0.5,4.8 0.5,3.27 1.26,2.51 7.47,2.51 C2.2 8.76,1.22 18.54,1.22 C6.2 ; 1.39,7.44 1.39,9.74 ; U6.2 4.57,20.47 v1(4.57,16.09) 6.36,16.09 7.48,17.21 ; C4.1 13.21,22.56 13.21,17.37 13.72,16.86 ; v1(23.61,17.54) R4.2 21.8,17.76 15.81,17.76 CN1_female1.43 13.72,16.86 ; 1.39,9.74 GND2.1 ; 7.48,17.21 11.66,17.21 12.01,16.86 13.72,16.86 ; 7.48,17.21 C3.1
  Bottom Layer w0.254: 3.05,14.82 3.3,14.82 4.52,16.03 ; 3.05,14.82 3.05,12.72 3.81,11.96 4,11.96 ; 3.05,14.82 FPC3.10 ; 24.93,10.19 24.88,10.24 24.88,13.16 ; 15.69,3.37 15.69,2.96 USB1.7 17.93,0.72 20.77,0.72 SW2.1 ; 15.69,3.37 12.67,3.37 12.16,3.88 USB1.5 10.81,4.89 USB1.9 ; 15.69,3.37 USB1.6 ; 3.76,10.3 3.81,10.35 v1(3.81,11.76) 4,11.96 ; 3.76,10.3 FPC3.9 ; 3.76,10.3 4.66,9.41 5.2,9.41 USB1.9 ; USB1.9 USB1.8 7.82,1.99 SW1.1 ; U2.2 4.01,18.25 4.01,16.54 4.52,16.03 ; 24.88,13.16 23.22,13.16 22.85,13.53 22.85,15.51 23.61,16.27 v1(23.61,17.54) 24.5,17.54 ; 24.88,13.16 25.76,13.16 ; 4.52,16.03 v1(4.57,16.09) ; 25.76,21.29 24.5,20.03 24.5,17.54 ; 4,11.96 FPC3.5 ; 24.5,17.54 25.03,17.54 R5.2
VBAT: length 3.6
  Top Layer w0.254: v1(2.65,20.59) 1.32,20.59 VBAT.1
  Bottom Layer w0.254: v1(2.65,20.59) 3.92,21.86 Q2.3
VCC_3V3: length 62.4
  Top Layer w0.171: C4.2 13.97,21.92 v1(13.97,20.52) ; CN1_female1.2 8.06,16.39 C3.2
  Top Layer w0.254: 3V3.1 4.49,15.19 v1(6.86,15.19) C3.2 ; R3.1 21.16,21.22 18.93,21.22 R1.1 17.98,22.17 C4.2
  VCC w0.171: v1(13.97,20.52) 10.43,16.98 8.65,16.98 v1(6.86,15.19)
  Bottom Layer w0.171: 18.66,16.64 19.26,16.03 U5.4
  Bottom Layer w0.254: U2.7 18.48,16.46 18.03,16.46 v1(13.97,20.52) ; v1(6.86,15.19) 6.13,15.19 FPC3.1 ; 19.26,7.91 24.91,7.91 24.93,7.89
ADC_IN1: length 17.6
  Top Layer w0.171: ADC1.1 26.35,6.58 26.35,8.37 25.84,8.87 25.33,8.87 18.22,15.99 14.92,15.99
ADC_IN2: length 13.7
  Top Layer w0.171: ADC2.1 17.98,15.59 CN1_female1.6
AIN1: length 3.5
  Top Layer w0.171: v1(16.3,11.6) 15.48,10.79 14.92,10.79
  Bottom Layer w0.171: U2.9 v1(16.3,11.6)
AIN2: length 2.9
  Top Layer w0.171: CN1_female1.28 14.17,11.19 v1(14.01,11.35)
  Bottom Layer w0.171: v1(14.01,11.35) 15.03,12.37 U2.10
AO1: length 28.9
  Top Layer w0.254: v1(11.22,25.03) 25.19,25.03 26.46,23.76 26.46,13.55 AO1.1
  Bottom Layer w0.254: v1(11.22,25.03) 10.45,24.27 U2.3
AO2: length 19.6
  Top Layer w0.254: AO2.1 20.59,15.11 20.59,15.36 18.8,17.16 v1(18.33,17.16)
  Bottom Layer w0.254: v1(18.33,17.16) 12.49,23 U2.4
BIN1: length 2.8
  Top Layer w0.171: v1(13.76,12.11) 13.88,11.99 14.92,11.99
  Bottom Layer w0.171: U2.11 12.99,12.87 v1(13.76,12.11)
BIN2: length 16.1
  Top Layer w0.171: CN1_female1.22 16.53,12.39 17.06,11.86 17.06,11.35 v1(16.55,10.84)
  GND w0.171: v1(9.18,15.67) 10.98,13.87 13.01,13.87 16.04,10.84 v1(16.55,10.84)
  Bottom Layer w0.171: U2.12 9.95,14.91 v1(9.18,15.67)
BO1: length 13.6
  Top Layer w0.254: v1(18.58,20.71) 19.48,19.82 22.78,19.82 BO1.1
  Bottom Layer w0.254: U2.5 v1(18.58,20.71)
BO2: length 14.7
  Top Layer w0.254: BO2.1 25.69,19.12 v1(25.69,19.95)
  Bottom Layer w0.254: v1(25.69,19.95) 25.95,19.95 26.71,20.71 26.71,23.76 26.2,24.27 U2.6
BOOT: length 13.4
  Top Layer w0.171: 18.28,2.86 18.78,2.86 20.31,4.38 20.31,5.65 15.57,10.39 CN1_female1.32
  Top Layer w0.254: C6.1 18.1,2.68 v1(18.35,2.93)
  Bottom Layer w0.254: SW2.2 18.35,1.98 v1(18.35,2.93)
COM_5V: length 52.3
  Top Layer w0.254: 8.38,3.57 8.38,3.25 C2.1 ; 8.38,3.57 1.91,3.57 ; 8.38,3.57 8.38,4.77 ; v1(18.97,5.6) 18.47,5.09 D1.1 18.4,4.77 8.38,4.77 ; 8.38,4.77 8.38,8.33 C1.1 ; 1.91,3.57 1.47,3.57 COM_5V.1 ; 1.91,3.57 v1(1.91,4.33)
  Bottom Layer w0.254: 24.93,5.59 24.92,5.6 v1(18.97,5.6) ; Q2.2 1.01,22.4 1.01,5.23 v1(1.91,4.33)
CS1: length 8.6
  Top Layer w0.171: 12.01,9.99 10.4,9.99 v1(10.23,10.16)
  GND w0.171: v1(7.18,13.2) v1(10.23,10.16)
  Bottom Layer w0.171: v1(7.18,13.2) 6.93,13.46 FPC3.2
CS2: length 13.9
  Top Layer w0.171: v1(14.04,9.15) 14.88,9.15 CN1_female1.38
  GND w0.171: v1(14.04,9.15) 13.79,8.89 7.94,8.89 v1(3.88,12.96)
  Bottom Layer w0.171: FPC3.3 v1(3.88,12.96)
CS3: length 11.8
  Top Layer w0.171: v1(13.53,9.92) 14.08,9.92 14.41,9.59 CN1_female1.36
  GND w0.171: v1(8.45,13.22) 9.72,13.22 10.62,12.32 11.13,12.32 v1(13.53,9.92)
  Bottom Layer w0.171: v1(8.45,13.22) 7.69,12.46 FPC3.4
EN: length 18.9
  Top Layer w0.171: 12.01,15.99 11.21,15.99 10.6,15.38 v1(10.6,15.13)
  Top Layer w0.254: 6.28,6.24 v1(5.52,5.47)
  VCC w0.171: v1(5.52,5.47) 5.52,6.24 10.01,10.73 10.01,14.54 v1(10.6,15.13)
  Bottom Layer w0.254: v1(5.52,5.47) 5.52,3 SW1.2
HEAT1: length 2.3
  Top Layer w0.254: v1(24.58,21.53) 25.09,21.02 HEAT1.1
  Bottom Layer w0.254: Q5.3 24.48,21.53 v1(24.58,21.53)
HEAT2: length 2.2
  Top Layer w0.254: v1(24.51,14.75) 25.02,15.25 HEAT2.1
  Bottom Layer w0.254: Q6.3 24.4,14.75 v1(24.51,14.75)
IO19: length 9.1
  Top Layer w0.171: 12.01,12.79 12.51,12.79 12.84,12.46 v1(12.84,9.47)
  Bottom Layer w0.171: USB1.2 14.11,8.2 v1(12.84,9.47)
IO20: length 10.3
  Top Layer w0.171: v1(11.18,13.02) 11.18,12.77 11.56,12.39 12.01,12.39
  Bottom Layer w0.171: v1(11.18,13.02) 11.18,8.45 13.46,6.16 USB1.3
LED: length 17
  Top Layer w0.171: v1(12.83,15.16) 12.04,15.16 12.01,15.19 ; 24.76,24.3 21.46,24.3 v1(19.18,22.01)
  GND w0.171: v1(19.18,22.01) 18.92,22.01 18.03,21.12 18.03,20.35 v1(12.83,15.16)
MISO: length 8.4
  Top Layer w0.171: v1(8.71,12.48) 9.2,11.99 12.01,11.99
  Bottom Layer w0.171: v1(8.71,12.48) 8.71,11.72 7.94,10.96 FPC3.7
MOSI: length 8.7
  Top Layer w0.171: v1(7.69,11.71) 7.69,10.95 8.59,10.05 8.82,10.05 9.56,10.79 12.01,10.79
  Bottom Layer w0.171: FPC3.6 7.44,11.46 v1(7.69,11.71)
PWM1: length 18.4
  Top Layer w0.171: CN1_female1.16 15.9,13.59 v1(16.26,13.22)
  Top Layer w0.254: v1(20.07,19.06) 20.58,18.56 R4.1
  GND w0.171: v1(20.07,19.06) 20.07,17.03 v1(16.26,13.22)
  Bottom Layer w0.254: v1(20.07,19.06) 20.07,20.59 22.68,23.19 Q5.1
PWM2: length 23.9
  Top Layer w0.171: 14.92,13.99 17.64,13.99 v1(19.89,11.73)
  Bottom Layer w0.171: 25.99,15.29 26.75,14.52 26.75,9.7 26.5,9.44 22.18,9.44 v1(19.89,11.73)
  Bottom Layer w0.254: Q6.1 26.03,15.33 26.03,18.04 R5.1
PWM4: length 12.2
  Top Layer w0.171: 12.01,15.59 11.5,15.59 11.25,15.33 11.25,14.82 10.99,14.57 2.87,14.57 PWM4.1
RXD0: length 17.2
  Top Layer w0.171: 14.92,14.79 17.71,14.79 21.3,11.19 21.3,7.79 RXD0.1
SCK: length 7.4
  Top Layer w0.171: 12.01,11.19 9.18,11.19 v1(8.71,10.71)
  Bottom Layer w0.171: v1(8.71,10.71) 8.45,10.46 FPC3.8
SCL: length 14.6
  Top Layer w0.171: v1(9.68,9.44) 9.94,9.19 12.01,9.19 ; v1(2.82,1.82) 2.06,1.82 SCL1.1
  VCC w0.171: v1(2.82,1.82) 9.68,8.68 v1(9.68,9.44)
SDA: length 11.7
  Top Layer w0.171: 12.01,13.59 10.74,13.59 10.48,13.84 3.41,13.84 SDA1.1
SLEEP: length 11.6
  Top Layer w0.171: v1(13.72,14.24) 13.72,13.48 14.41,12.79 14.92,12.79
  Bottom Layer w0.171: v1(13.72,14.24) 13.36,14.59 12.09,14.59 9.4,17.29 U2.1
TXD0: length 20.8
  Top Layer w0.171: CN1_female1.8 17.85,15.19 22.34,10.7 22.34,7.65 25.03,4.95 25.28,4.95 26.48,3.76 26.48,2.37 TXD0.1
VM: length 22.4
  Top Layer w0.254: VM.1 1.42,13.98 v1(2.31,13.98)
  VCC w0.254: v1(2.31,13.98) 8.4,13.98 10.18,15.76 19.32,15.76 v1(19.83,15.25)
  Bottom Layer w0.254: U2.8 v1(19.83,15.25)
VUSB: length 36.4
  Top Layer w0.254: v1(16.89,7.02) 18.41,7.02 19.63,5.8 D1.2
  Bottom Layer w0.254: Q2.1 1.92,20.4 2.43,19.89 3.19,19.89 4.21,20.91 12.08,20.91 18.69,14.3 18.69,11.51 16.89,9.71 v1(16.89,7.02) USB1.1
$1N7567: length 16.4
  Top Layer w0.254: R1.2 17.28,24.39 U6.1
$1N10088: length 3.4
  Top Layer w0.254: LED1.2 24.53,23.22 R3.2

## Copper pours and planes (outline as drawn; the poured copper is in the pictures)
GND on GND: 0.76,25.03 4.95,25.03 4.95,17.67 22.95,17.79 22.9,25.36 26.99,25.36 27.18,25.54 27.18,0.25 0.78,0.25 0.51,0.52 0.51,24.78
COM_5V on VCC: 0.25,9.73 27.05,9.73 27.05,0.22 0.24,0.22 0.25,0.47
VM on VCC: 4.98,25.02 4.98,17.94 4.83,17.79 22.73,17.79 22.86,17.67 22.86,25.03 22.99,25.16 26.8,25.16 27.05,25.41 27.05,9.92 26.92,9.79 0.25,9.79 0.25,24.91 0.38,25.03 0.39,25.02

Small or netless copper shapes (teardrops, artwork), in the pictures only: 1 on VCC
